# Altium schematic sheet WIFI_module.SchDoc
size A
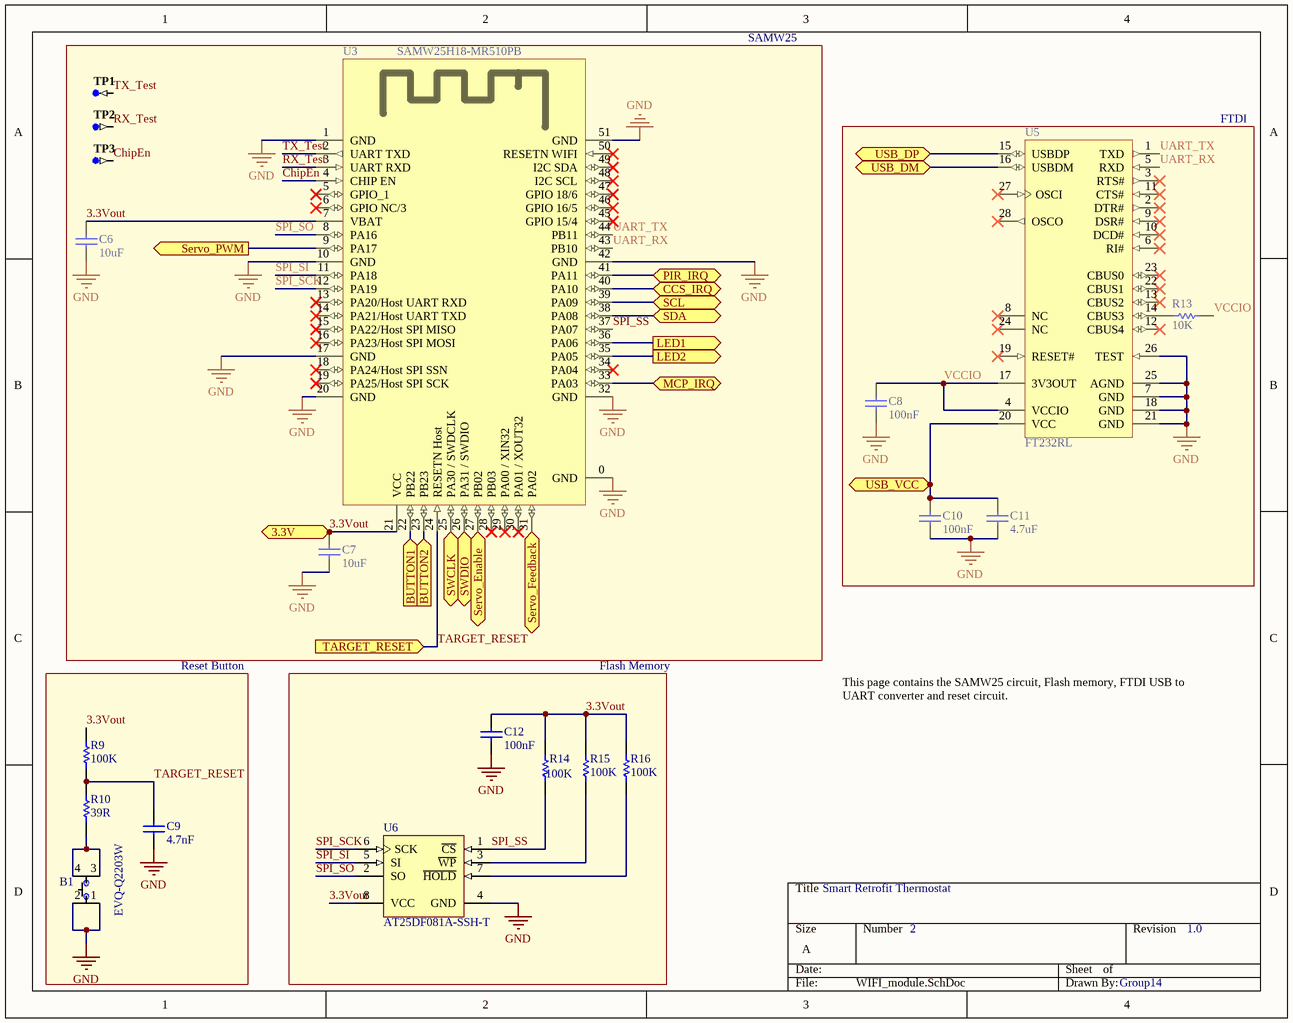
[diagram p0: WIFI_module.SchDoc]

## Parts
B1  EVQ-Q2203W  [EVQ-Q2203W]
C6  10uF  [CAPC0805(2012)100_L]
C7  10uF  [CAPC0805(2012)100_L]
C8  100nF  [CAPC0805(2012)145_M]
C9  4.7nF  [CAPC0805(2012)100_L]
C10  100nF  [CAPC0805(2012)145_M]
C11  4.7uF  [CAPC0805(2012)155_L]
C12  100nF  [CAPC0805(2012)145_M]
R9  100K  [RESC0805(2012)_L]
R10  39R  [RESC0805(2012)_N]
R13  10K  [RESC0805(2012)_M]
R14  100K  [RESC0805(2012)_L]
R15  100K  [RESC0805(2012)_L]
R16  100K  [RESC0805(2012)_L]
TP1  (no value)  [TP-SM-C-100]  (no BOM)
TP2  (no value)  [TP-SM-C-100]  (no BOM)
TP3  (no value)  [TP-SM-C-100]  (no BOM)
U3  SAMW25H18-MR510PB  [SAMW25H18-MR510PB]
U5  FT232RL  [FTDI-SSOP-28_M]
U6  AT25DF081A-SSH-T  [AT25DF081A-SSH-T]

## Blocks framed on the sheet
SAMW25: C6 C7 TP1-TP3 U3
FTDI: C8 C10 C11 R13 U5
Reset Button: B1 C9 R9 R10
Flash Memory: C12 R14-R16 U6

## Ports
3.3V, BUTTON1 (in), BUTTON2 (in), CCS_IRQ, LED1 (out), LED2 (out), MCP_IRQ, PIR_IRQ, SCL (bidir), SDA (bidir), Servo_Enable (out), Servo_Feedback (in), Servo_PWM (out), SWCLK (bidir), SWDIO (bidir), TARGET_RESET (in), USB_DM, USB_DP, USB_VCC

## Nets
GND: B1.1 B1.2 C6.1 C7.1 C8.1 C9.1 C10.1 C11.1 C12.1 U3.0(GND) U3.1(GND) U3.10(GND) U3.17(GND) U3.20(GND) U3.32(GND) U3.42(GND) U3.51(GND) U5.7(GND) U5.18(GND) U5.21(GND) U5.25(AGND) U5.26(TEST) U6.4(GND)
3.3Vout: C6.2 C7.2 C12.2 R9.1 R14.1 R15.1 R16.1 U3.7(VBAT) U3.21(VCC) U6.8(VCC) ; port 3.3V
BUTTON1: U3.22(PB22) ; port BUTTON1
BUTTON2: U3.23(PB23) ; port BUTTON2
CCS_IRQ: U3.40(PA10) ; port CCS_IRQ
ChipEn: TP3.1 U3.4(CHIP_EN)
LED1: U3.36(PA06) ; port LED1
LED2: U3.35(PA05) ; port LED2
MCP_IRQ: U3.33(PA03) ; port MCP_IRQ
PIR_IRQ: U3.41(PA11) ; port PIR_IRQ
RX_Test: TP2.1 U3.3(UART_RXD)
SCL: U3.39(PA09) ; port SCL
SDA: U3.38(PA08) ; port SDA
Servo_Enable: U3.27(PB02) ; port Servo_Enable
Servo_Feedback: U3.31(PA02) ; port Servo_Feedback
Servo_PWM: U3.9(PA17) ; port Servo_PWM
SPI_SCK: U3.12(PA19) U6.6(SCK)
SPI_SI: U3.11(PA18) U6.5(SI)
SPI_SO: U3.8(PA16) U6.2(SO)
SPI_SS: R14.2 U3.37(PA07) U6.1(~{CS})
SWCLK: U3.25(PA30_/_SWDCLK) ; port SWCLK
SWDIO: U3.26(PA31_/_SWDIO) ; port SWDIO
TARGET_RESET: C9.2 R9.2 R10.1 U3.24(RESETN_Host) ; port TARGET_RESET
TX_Test: TP1.1 U3.2(UART_TXD)
UART_RX: U3.43(PB10) U5.5(RXD)
UART_TX: U3.44(PB11) U5.1(TXD)
USB_DM: U5.16(USBDM) ; port USB_DM
USB_DP: U5.15(USBDP) ; port USB_DP
USB_VCC: C10.2 C11.2 U5.20(VCC) ; port USB_VCC
VCCIO: C8.2 R13.2 U5.4(VCCIO) U5.17(3V3OUT)
NetB1_3: B1.3 B1.4 R10.2
NetR13_1: R13.1 U5.14(CBUS3)
NetR15_2: R15.2 U6.3(~{WP})
NetR16_2: R16.2 U6.7(~{HOLD})

Not connected (* = marked no-connect by the designer): U3 5(GPIO_1)* 6(GPIO_NC/3)* 13(PA20/Host_UART_RXD)* 14(PA21/Host_UART_TXD)* 15(PA22/Host_SPI_MISO)* 16(PA23/Host_SPI_MOSI)* 18(PA24/Host_SPI_SSN)* 19(PA25/Host_SPI_SCK)* 28(PB03)* 29(PA00_/_XIN32)* 30(PA01_/_XOUT32)* 34(PA04)* 45(GPIO_15/4)* 46(GPIO_16/5)* 47(GPIO_18/6)* 48(I2C_SCL)* 49(I2C_SDA)* 50(RESETN_WIFI)*; U5 2(DTR#)* 3(RTS#)* 6(RI#)* 8(NC)* 9(DSR#)* 10(DCD#)* 11(CTS#)* 12(CBUS4)* 13(CBUS2)* 19(RESET#)* 22(CBUS1)* 23(CBUS0)* 24(NC)* 27(OSCI)* 28(OSCO)*

## Notes on the sheet
- This page contains the SAMW25 circuit, Flash memory, FTDI USB to UART converter and reset circuit.
- Smart Retrofit Thermostat
- 2
- 1.0
- Group14

## Library data of the parts
B1 = EVQ-Q2203W: SWITCH TACTILE SPST-NO 0.02A 15V; Manufacturer: Panasonic Electronic Components; Switch Function: Off-Mom; Contact Rating @ Voltage: 0.02A @ 15VDC; Actuator Type: Standard; Actuator Height off PCB, Vertical: 3.10mm; Actuator Orientation: Top Actuated; Outline: 6.60mm x 6.00mm; Illumination: Non-Illuminated; Operating Force: 350gf; Switch Travel: 0.25mm; Mechanical Life: 100,000 Cycles; Supplier 1: Digi-Key; Manufacturer Part Number: EVQ-Q2203W; RoHS: RoHS Compliant; Category: Switches; Stock 1: 15024; Pricing 1: 1=0.3, 10=0.287, 25=0.2772, 50=0.2674, 100=0.2525, 250=0.2376, 500=0.2277, 1000=0.17325 (USD); Packaging: Cut Tape (CT); Part Status: Active; Circuit: SPST-NO; Mounting Type: Surface Mount; Actuator Length, Right Angle: -; Termination Style: J Lead; Illumination Type, Color: -; Illumination Voltage (Nominal): -; Ingress Protection: -; Features: Grounding Pin; Actuator Material: -; Operating Temperature: -40°C ~ 85°C; ComponentLink1URL: https://industrial.panasonic.com/cdbs/www-data/pdf/ATK0000/ATK0000CE28.pdf; ComponentLink1Description: https://industrial.panasonic.com/cdbs/www-data/pdf/ATK0000/ATK0000CE28.pdf; Supplier Part Number 1: P12964SCT-ND
C6 C7 = CMP-1036-04930-1: CAP 10uF 16V ±20% 0805 (2012 Metric) Thickness 1mm SMD; Case-EIA: 0805; Tolerance: Â±20%; Case-Metric: 2012; Value: 10uF; Rated Voltage: 16 V; Max Thickness: 1 mm; Technology: SMT
C8 C10 C12 = CMP-1036-04404-1: CAP 100nF 16V ±20% 0805 (2012 Metric) Thickness 1.45mm SMD; Case-EIA: 0805; Tolerance: Â±20%; Case-Metric: 2012; Value: 100nF; Rated Voltage: 16 V; Max Thickness: 1.45 mm; Technology: SMT
C9 = CMP-1036-03568-1: CAP 4.7nF 16V ±20% 0805 (2012 Metric) Thickness 1mm SMD; Case-EIA: 0805; Tolerance: Â±20%; Case-Metric: 2012; Value: 4.7nF; Rated Voltage: 16 V; Max Thickness: 1 mm; Technology: SMT
C11 = CMP-1036-04882-1: CAP 4.7uF 10V ±10% 0805 (2012 Metric) Thickness 1.55mm SMD; Case-EIA: 0805; Tolerance: Â±10%; Case-Metric: 2012; Value: 4.7uF; Rated Voltage: 10 V; Max Thickness: 1.55 mm; Technology: SMT
R9 R14-R16 = CMP-1013-00736-1: 100K 0.125W 1% 0805 (2012 Metric)  SMD; Value: 100000.00 Ohm; Case-Metric: 2012; Case-EIA: 0805; Technology: SMT; Power: 0.125 W; Tolerance: 1 %
R10 = CMP-1013-00350-1: 39R 0.125W 1% 0805 (2012 Metric)  SMD; Value: 39.00 Ohm; Case-Metric: 2012; Case-EIA: 0805; Technology: SMT; Power: 0.125 W; Tolerance: 1 %
R13 = CMP-1013-00623-1: 10K 0.125W 1% 0805 (2012 Metric)  SMD; Value: 10000.00 Ohm; Case-Metric: 2012; Case-EIA: 0805; Technology: SMT; Power: 0.125 W; Tolerance: 1 %
TP1-TP3 = CMP-0484-00002-2: Test Point, Surface Mount, Circular, Pad Diameter 1 mm; Manufacturer: No Vendor; PartNumber: TP-SM-C-100
U3 = SAMW25H18-MR510PB: RF TXRX MODULE WIFI TRACE ANT; Manufacturer: Atmel; Manufacturer Part Number: ATSAMW25H18-MR510PB; Protocol: 802.11b/g/n; Frequency: 2.4GHz; Data Rate: 65Mbps; Power - Output: 17dBm; Sensitivity: -95.5dBm; Serial Interfaces: SPI, UART; Antenna Type: Integrated, Trace; Memory Size: 256kB Flash, 32kB SRAM; Voltage - Supply: 2.7 V ~ 4.2 V; Category: RF/IF and RFID; Family: RF Transceiver Modules; Series: Xplained Pro; Packaging: Tray; RF Family/Standard: WiFi; Modulation: -; Current - Receiving: -; Current - Transmitting: -; Mounting Type: Surface Mount; Operating Temperature: -40°C ~ 85°C; Package / Case: Module; ComponentLink1URL: http://www.atmel.com/devices/ATSAMW25.aspx; ComponentLink1Description: http://www.atmel.com/devices/ATSAMW25.aspx; ComponentLink2URL: http://www.farnell.com/datasheets/1965115.pdf; ComponentLink2Description: http://www.farnell.com/datasheets/1965115.pdf; Supplier 1: Digikey; Stock 1: 120; Pricing 1: 1=19.14 (USD); Supplier Part Number 1: ATSAMW25H18-MR510PB-ND
U5 = CMP-2000-05029-1: IC USB FS SERIAL UART 28-SSOP; Manufacturer: FTDI; Receive FIFO: 256B; Number of Channels per Chip: 1; Maximum Data Rate: 3MBd; Transmit FIFO: 128B; Dimensions: 10.2x5.3x1.75mm; Mounting Type: SurfaceMount; Height: 1.75mm; Package Type: SSOP; Datasheet Version: Rev. 1.04, 02/2006; Width: 5.3mm; Manufacturer URL: http://www.ftdichip.com/; Datasheet URL: http://datasheet.octopart.com/FT232RL-FTDI-datasheet-120501.pdf; Maximum Operating Temperature: +85degC; Minimum Operating Temperature: -40degC; Pin Count: 28; Length: 10.2mm
U6 = AT25DF081A-SSH-T: IC FLASH 8MBIT 100MHZ 8SOIC; Manufacturer: Adesto Technologies; Memory Size: 8M (4096 pages x 256 bytes); Interface: SPI, RapidS; Voltage - Supply: 2.7 V ~ 3.6 V; Rad Hard: No; Manufacturer Part Number: AT25DF081A-SSH-T; RoHS: RoHS Compliant; Category: Integrated Circuits (ICs); Packaging: Cut Tape (CT); Part Status: Active; Format - Memory: FLASH; Memory Type: FLASH; Speed: 100MHz; Operating Temperature: -40°C ~ 85°C (TC); Package / Case: 8-SOIC (0.154", 3.90mm Width); Supplier Device Package: 8-SOIC; ComponentLink1URL: http://www.adestotech.com/wp-content/uploads/doc8715.pdf; ComponentLink1Description: http://www.adestotech.com/wp-content/uploads/doc8715.pdf; Supplier 1: Digikey; Stock 1: 2550; Pricing 1: 1=1.18, 10=1.081, 25=1.0516, 50=1.0462, 100=0.9352, 250=0.9324, 500=0.9185, 1000=0.8791 (USD); Package: 8SOIC; ComponentLink2URL: https://datasheet.ciiva.com/14084/doc8715-14084443.pdf; ComponentLink2Description: https://datasheet.ciiva.com/14084/doc8715-14084443.pdf; ComponentLink3URL: https://datasheet.ciiva.com/26910/getdatasheetpartid-730210-26910875.pdf; ComponentLink3Description: https://datasheet.ciiva.com/26910/getdatasheetpartid-730210-26910875.pdf; ComponentLink4URL: https://datasheet.ciiva.com/12251/doc8715-12251468.pdf; ComponentLink4Description: https://datasheet.ciiva.com/12251/doc8715-12251468.pdf; Supplier Part Number 1: 1265-1166-1-ND